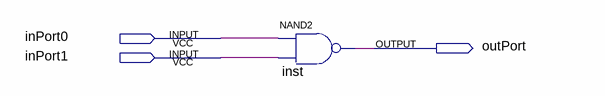
[diagram p0: schematic sheet]
// Quartus schematic GateDemo.bdf as structural Verilog: 1 symbols, 3 pins
module GateDemo (
  input  inPort0,
  input  inPort1,
  output outPort
);

  nand inst (outPort, inPort0, inPort1);
endmodule
